# Altium schematic sheet EDP and MIPI DSI Connectors.SchDoc
size A4; SheetNumber: 22; SheetTotal: 26
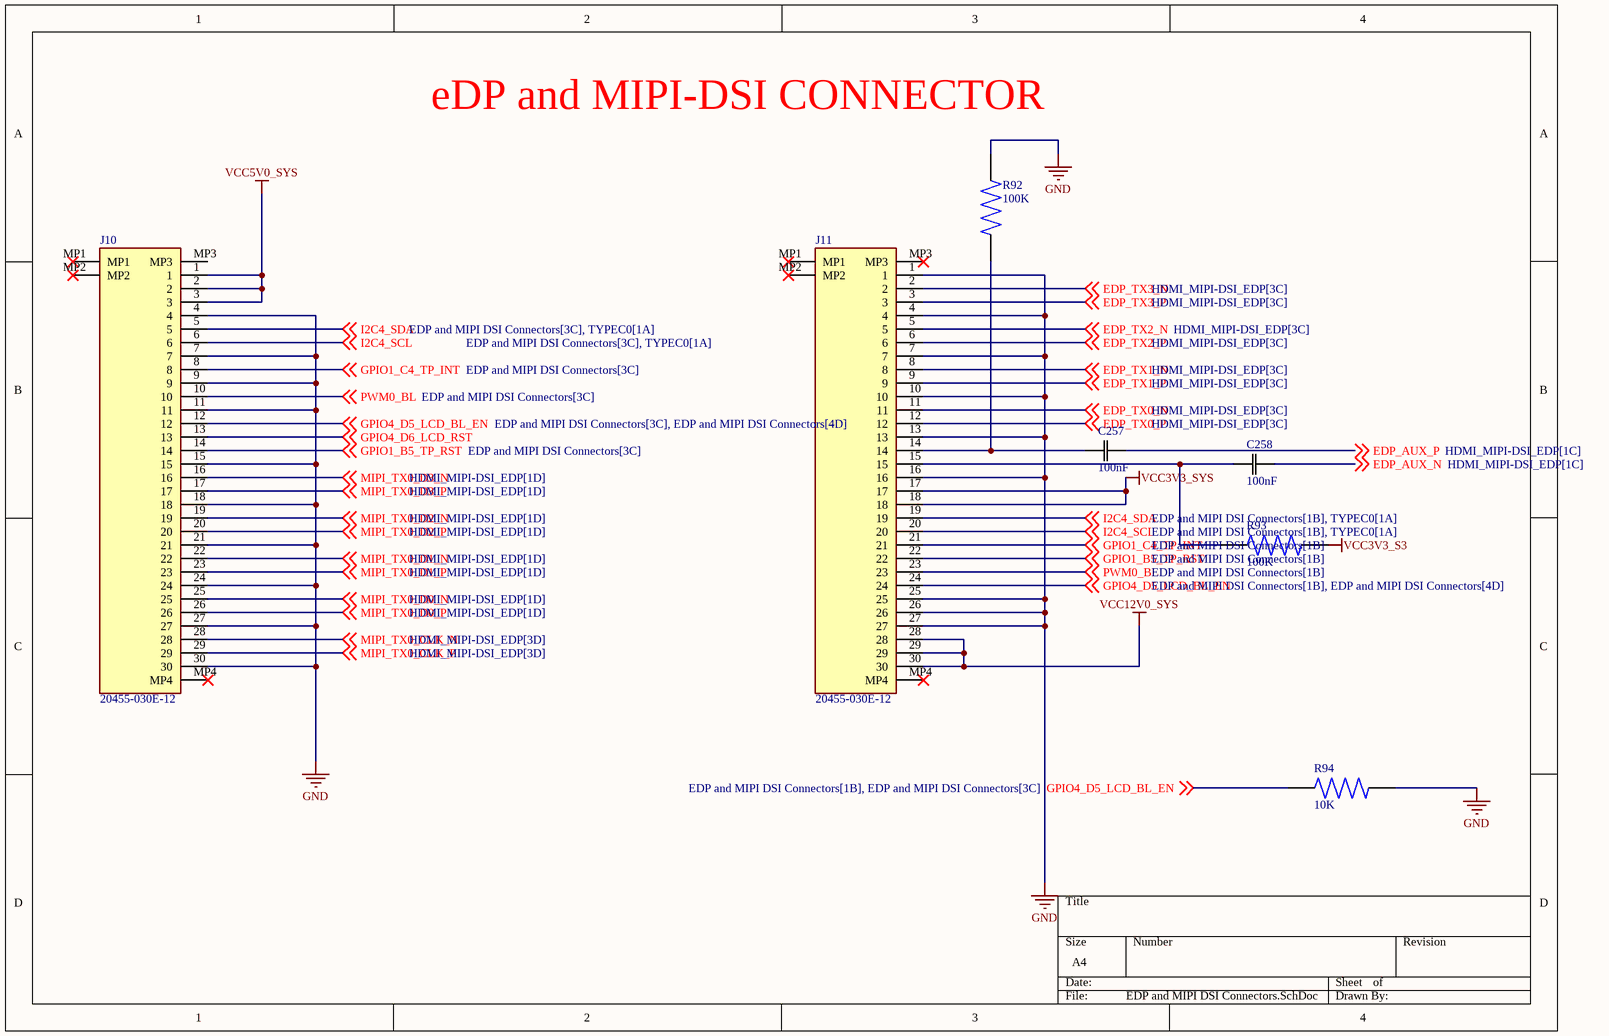
[diagram p0: EDP and MIPI DSI Connectors.SchDoc]

## Parts
C257  100nF  [CAP_1005_TDK]
C258  100nF  [CAP_1005_TDK]
J10  20455-030E-12  [20455030E12]
J11  20455-030E-12  [20455030E12]
R92  100K  [RES_ERA3ARB103V]
R93  100K  [RES_ERA3ARB103V]
R94  10K  [RES_ERA3ARB103V]

## Nets
GND: J10.4 J10.7 J10.9 J10.11 J10.15 J10.18 J10.21 J10.24 J10.27 J10.30 J11.1 J11.4 J11.7 J11.10 J11.13 J11.16 J11.25 J11.26 J11.27 R92.2 R94.1
VCC3V3_S3: R93.1
VCC3V3_SYS: J11.17 J11.18
VCC5V0_SYS: J10.1 J10.2 J10.3
VCC12V0_SYS: J11.28 J11.29 J11.30
EDP_AUX_N: C258.1 ; off-sheet EDP_AUX_N
EDP_AUX_P: C257.1 ; off-sheet EDP_AUX_P
EDP_TX0_N: J11.11 ; off-sheet EDP_TX0_N
EDP_TX0_P: J11.12 ; off-sheet EDP_TX0_P
EDP_TX1_N: J11.8 ; off-sheet EDP_TX1_N
EDP_TX1_P: J11.9 ; off-sheet EDP_TX1_P
EDP_TX2_N: J11.5 ; off-sheet EDP_TX2_N
EDP_TX2_P: J11.6 ; off-sheet EDP_TX2_P
EDP_TX3_N: J11.2 ; off-sheet EDP_TX3_N
EDP_TX3_P: J11.3 ; off-sheet EDP_TX3_P
GPIO1_B5_TP_RST: J10.14 J11.22 ; off-sheet GPIO1_B5_TP_RST
GPIO1_C4_TP_INT: J10.8 J11.21 ; off-sheet GPIO1_C4_TP_INT
GPIO4_D5_LCD_BL_EN: J10.12 J11.24 R94.2 ; off-sheet GPIO4_D5_LCD_BL_EN
GPIO4_D6_LCD_RST: J10.13 ; off-sheet GPIO4_D6_LCD_RST
I2C4_SCL: J10.6 J11.20 ; off-sheet I2C4_SCL
I2C4_SDA: J10.5 J11.19 ; off-sheet I2C4_SDA
MIPI_TX0_CLK_N: J10.28 ; off-sheet MIPI_TX0_CLK_N
MIPI_TX0_CLK_P: J10.29 ; off-sheet MIPI_TX0_CLK_P
MIPI_TX0_D0_N: J10.25 ; off-sheet MIPI_TX0_D0_N
MIPI_TX0_D0_P: J10.26 ; off-sheet MIPI_TX0_D0_P
MIPI_TX0_D1_N: J10.22 ; off-sheet MIPI_TX0_D1_N
MIPI_TX0_D1_P: J10.23 ; off-sheet MIPI_TX0_D1_P
MIPI_TX0_D2_N: J10.19 ; off-sheet MIPI_TX0_D2_N
MIPI_TX0_D2_P: J10.20 ; off-sheet MIPI_TX0_D2_P
MIPI_TX0_D3_N: J10.16 ; off-sheet MIPI_TX0_D3_N
MIPI_TX0_D3_P: J10.17 ; off-sheet MIPI_TX0_D3_P
PWM0_BL: J10.10 J11.23 ; off-sheet PWM0_BL
NetC257_2: C257.2 J11.14 R92.1
NetC258_2: C258.2 J11.15 R93.2

Not connected (* = marked no-connect by the designer): J10 MP1* MP2* MP3 MP4*; J11 MP1* MP2* MP3* MP4*

## Notes on the sheet
- eDP and MIPI-DSI CONNECTOR

## Library data of the parts
C257 C258 = C1005X7R1H104M050BB: Description; Manufacturer_Name: TDK; Copyright: Copyright (C) 2025 Ultra Librarian. All rights reserved.; Manufacturer_Part_Number: C1005X7R1H104M050BB
J10 J11 = 20455-030E-12: Board Connector, 30 Contact(s), 1 Row(s), Female, Right Angle, Surface Mount Terminal, Receptacle; Manufacturer_Name: I-Pex; Geometry.Height: 1.1mm; Manufacturer_Part_Number: 20455-030E-12; Mouser Part Number: *; Mouser Price/Stock: *; Arrow Part Number: *; Arrow Price/Stock: *; Datasheet Link: https://www.datasheet5.com/part/20455-030E-12/I-PEX%20Co%20Ltd
R92-R94 = ERA3ARB103V: MP: ERA3ARB103V; Availability: Unavailable; Package: None; Value: *; Price: None